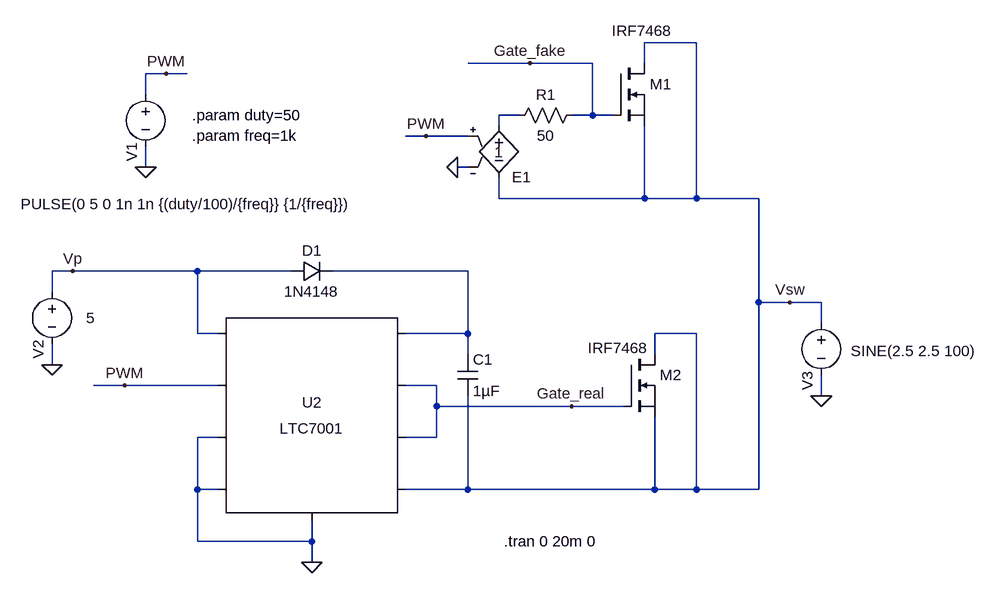
[diagram p0: schematic OL_gate_drivers.asc]
OL_gate_drivers.asc, the LTspice schematic file:
Version 4
SHEET 1 1332 852
WIRE 896 -368 816 -368
WIRE 640 -336 544 -336
WIRE 736 -336 640 -336
WIRE 816 -336 816 -368
WIRE 80 -320 48 -320
WIRE 112 -320 80 -320
WIRE 48 -288 48 -320
WIRE 624 -256 592 -256
WIRE 736 -256 736 -336
WIRE 736 -256 704 -256
WIRE 768 -256 736 -256
WIRE 592 -240 592 -256
WIRE 480 -224 448 -224
WIRE 544 -224 480 -224
WIRE 48 -176 48 -208
WIRE 544 -176 528 -176
WIRE 592 -128 592 -160
WIRE 816 -128 816 -240
WIRE 816 -128 592 -128
WIRE 896 -128 896 -368
WIRE 896 -128 816 -128
WIRE 992 -128 896 -128
WIRE -64 -16 -96 -16
WIRE 128 -16 -64 -16
WIRE 272 -16 128 -16
WIRE 544 -16 336 -16
WIRE -96 16 -96 -16
WIRE 992 32 992 -128
WIRE 1040 32 992 32
WIRE 1088 32 1040 32
WIRE 1088 64 1088 32
WIRE 128 80 128 -16
WIRE 160 80 128 80
WIRE 544 80 544 -16
WIRE 544 80 448 80
WIRE 896 80 832 80
WIRE 544 112 544 80
WIRE 832 112 832 80
WIRE -96 128 -96 96
WIRE 16 160 -32 160
WIRE 160 160 16 160
WIRE 496 160 448 160
WIRE 1088 176 1088 144
WIRE 496 192 496 160
WIRE 704 192 496 192
WIRE 784 192 704 192
WIRE 160 240 128 240
WIRE 496 240 496 192
WIRE 496 240 448 240
WIRE 128 320 128 240
WIRE 160 320 128 320
WIRE 544 320 544 176
WIRE 544 320 448 320
WIRE 832 320 832 208
WIRE 832 320 544 320
WIRE 896 320 896 80
WIRE 896 320 832 320
WIRE 992 320 992 32
WIRE 992 320 896 320
WIRE 128 400 128 320
WIRE 304 400 304 368
WIRE 304 400 128 400
WIRE 304 432 304 400
FLAG 1088 176 0
FLAG -64 -16 Vp
FLAG 528 -176 0
FLAG 48 -176 0
FLAG 80 -320 PWM
FLAG 480 -224 PWM
FLAG 16 160 PWM
FLAG -96 128 0
FLAG 640 -336 Gate_fake
FLAG 704 192 Gate_real
FLAG 304 432 0
FLAG 1040 32 Vsw
SYMBOL diode 272 0 R270
WINDOW 0 32 32 VTop 2
WINDOW 3 0 32 VBottom 2
SYMATTR InstName D1
SYMATTR Value 1N4148
SYMBOL cap 528 112 R0
SYMATTR InstName C1
SYMATTR Value 1µF
SYMBOL voltage 48 -304 R0
WINDOW 123 0 0 Left 2
WINDOW 39 0 0 Left 2
WINDOW 3 -192 185 Left 2
WINDOW 0 -21 90 VRight 2
SYMATTR Value PULSE(0 5 0 1n 1n {(duty/100)/{freq}} {1/{freq}})
SYMATTR InstName V1
SYMBOL nmos 768 -336 R0
WINDOW 3 -2 -50 Left 2
SYMATTR InstName M1
SYMATTR Value IRF7468
SYMBOL res 720 -272 R90
WINDOW 0 0 56 VBottom 2
WINDOW 3 32 56 VTop 2
SYMATTR InstName R1
SYMATTR Value 50
SYMBOL e 592 -256 R0
WINDOW 0 20 95 Left 2
WINDOW 3 -7 57 Left 2
SYMATTR InstName E1
SYMATTR Value 1
SYMBOL voltage -96 0 R0
WINDOW 123 0 0 Left 2
WINDOW 39 0 0 Left 2
WINDOW 3 66 56 Right 2
WINDOW 0 -21 90 VRight 2
SYMATTR Value 5
SYMATTR InstName V2
SYMBOL voltage 1088 48 R0
WINDOW 123 0 0 Left 2
WINDOW 39 0 0 Left 2
WINDOW 3 239 59 Right 2
WINDOW 0 -21 90 VRight 2
SYMATTR Value SINE(2.5 2.5 100)
SYMATTR InstName V3
SYMBOL nmos 784 112 R0
WINDOW 3 -55 -10 Left 2
SYMATTR InstName M2
SYMATTR Value IRF7468
SYMBOL PowerProducts\\LTC7001 304 208 R0
SYMATTR InstName U2
TEXT 600 400 Left 2 !.tran 0 20m 0
TEXT 120 -256 Left 2 !.param duty=50\n.param freq=1k

The netlist it stands for:
* OL_gate_drivers.asc
D1 Vp N002 1N4148
C1 N002 Vsw 1µF
V1 PWM 0 PULSE(0 5 0 1n 1n {(duty/100)/{freq}} {1/{freq}})
M1 Vsw Gate_fake Vsw Vsw IRF7468
R1 Gate_fake N001 50
E1 N001 Vsw PWM 0 1
V2 Vp 0 5
V3 Vsw 0 SINE(2.5 2.5 100)
M2 Vsw Gate_real Vsw Vsw IRF7468
XU2 Vp 0 0 PWM 0 Gate_real Gate_real Vsw N002 LTC7001
.model D D
.lib standard.dio
.model NMOS NMOS
.model PMOS PMOS
.lib standard.mos
.tran 0 20m 0
.param duty=50
.param freq=1k
.lib LTC7001.sub
.backanno
.end